# EAGLE design sfp-experimenter (EAGLE 7.7.0)
VERSION: v2
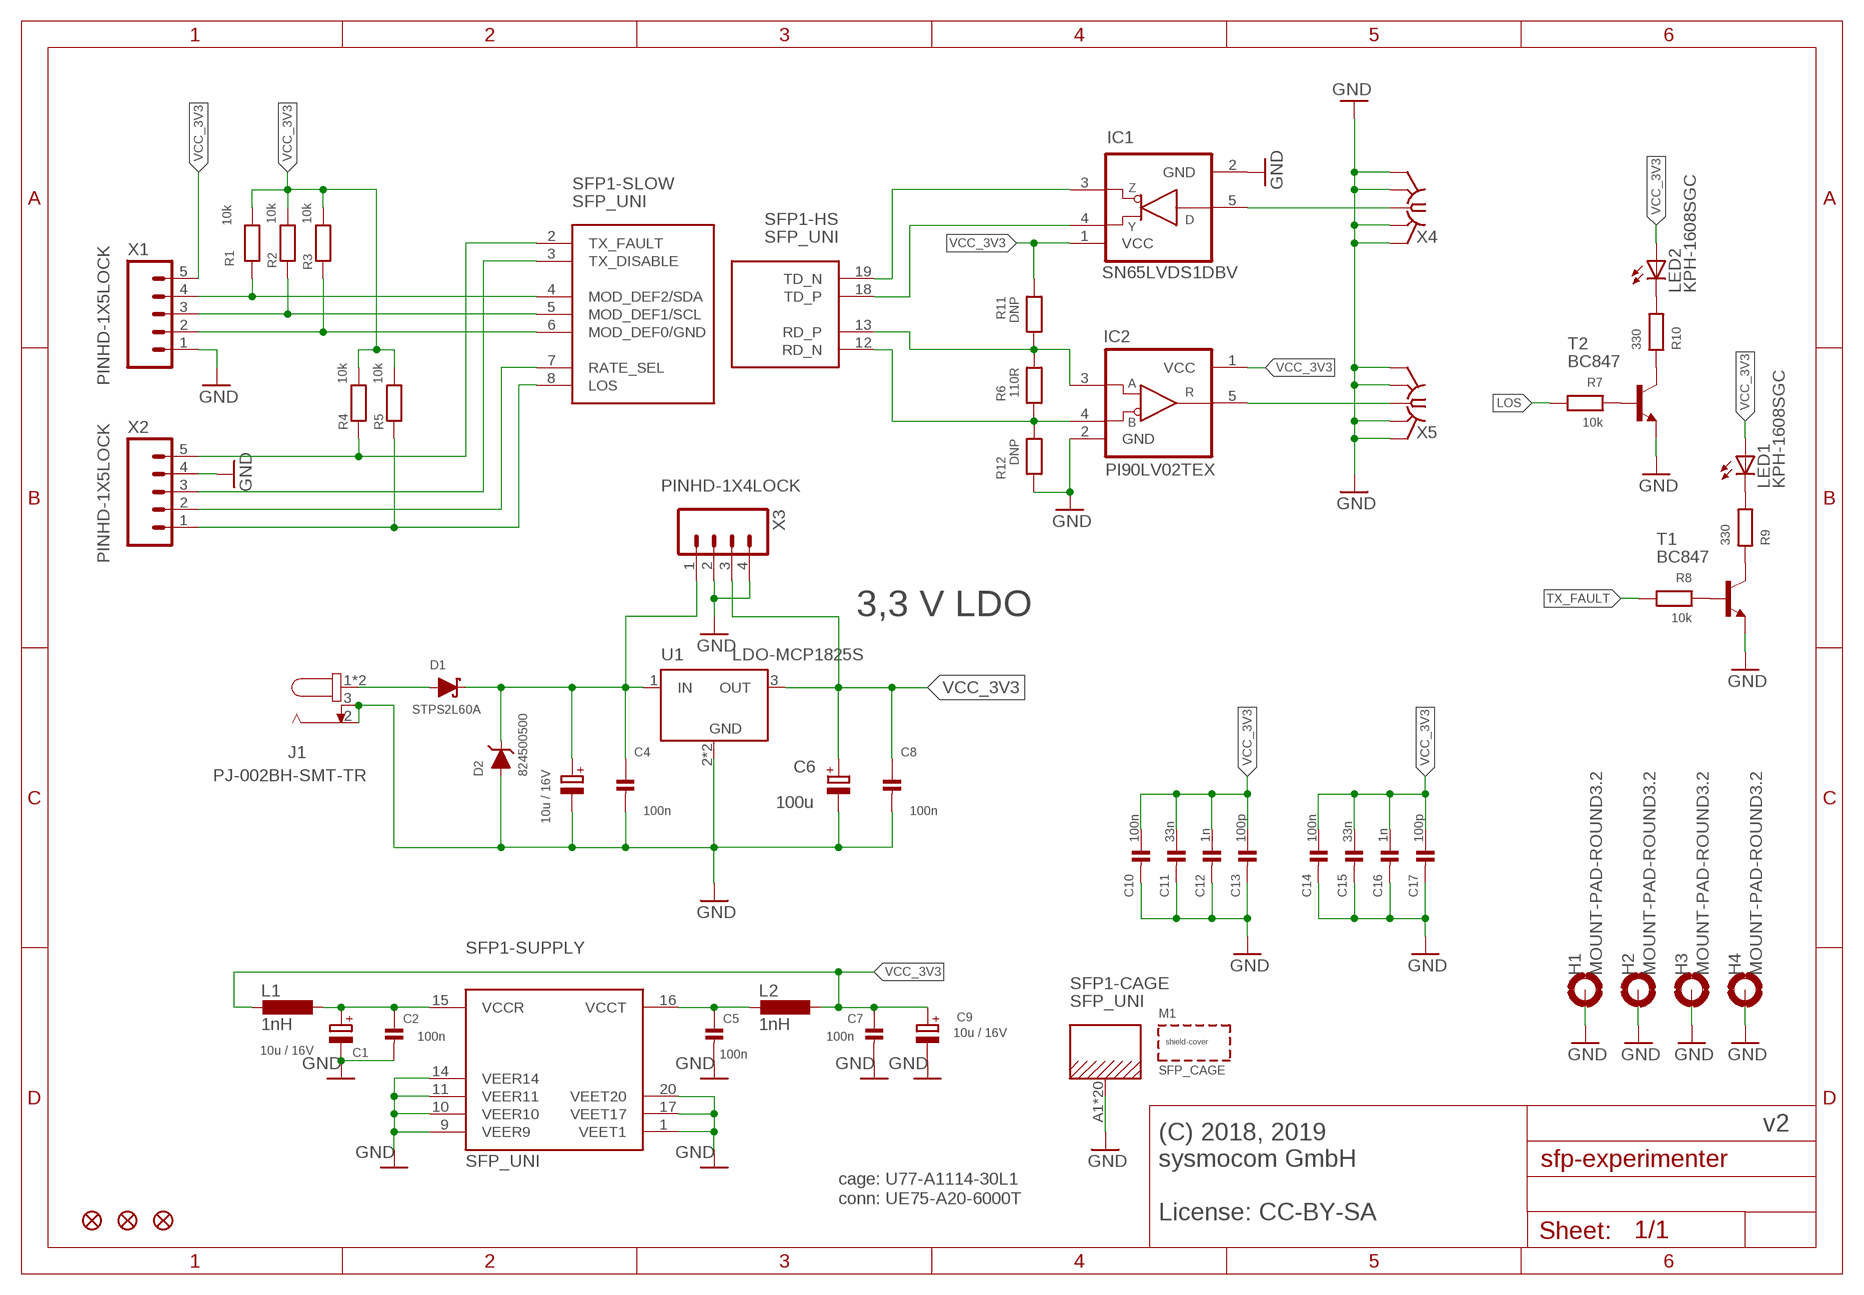
[diagram p0: schematic, sheet 1]
M1 (SHIELD-COVER): CLASS: MECHANICAL; DESCRIPTION: CONN SFP CAGE SLD R/A; LINK: https://www.digikey.de/product-detail/de/amphenol-icc-commercial-products/U77-A1114-30L1/U77-A1114-30L1-ND; MANUFACTURER: Amphenol ICC (Commercial Products); MANUFACTURERPARTNUMBER: U77-A1114-30L1; POPULATED: TRUE; ROHSCERTIFICATE: UNKNOWN ROHS CERTIFICATE; SCHEM_BOM_ITEM: TRUE; SOURCE: DIGIKEY; SOURCEPARTNUMBER: U77-A1114-30L1-ND

## Parts
C1  10u / 16V  CPOL-EU-1206  [CPOL1206]
C2  100n  CAP_CERAMIC_0603  [_0603]
C3  10u / 16V  CPOL-EU-1206  [CPOL1206]
C4  100n  CAP_CERAMIC_0603  [_0603]
C5  100n  CAP_CERAMIC_0603  [_0603]
C6  100u  CPOL-EUCT6032  [CT6032]
C7  100n  CAP_CERAMIC_0603  [_0603]
C8  100n  CAP_CERAMIC_0603  [_0603]
C9  10u / 16V  CPOL-EU-1206  [CPOL1206]
C10  100n  CAP_CERAMIC_0603  [_0603]
C11  33n  CAP_CERAMIC_0603  [_0603]
C12  1n  CAP_CERAMIC_0603  [_0603]
C13  100p  CAP_CERAMIC_0603  [_0603]
C14  100n  CAP_CERAMIC_0603  [_0603]
C15  33n  CAP_CERAMIC_0603  [_0603]
C16  1n  CAP_CERAMIC_0603  [_0603]
C17  100p  CAP_CERAMIC_0603  [_0603]
D1  STPS2L60A  DIODE-SCHOTTKY-SMA  [SMADIODE]
D2  824500500  DIODE-TVS-SMA  [SMADIODE]
FID1  FIDUCIAL1X2.5  [FIDUCIAL-1X2.5]
FID2  FIDUCIAL1X2.5  [FIDUCIAL-1X2.5]
FID3  FIDUCIAL1X2.5  [FIDUCIAL-1X2.5]
H1  MOUNT-PAD-ROUND3.2  [3,2-PAD]
H2  MOUNT-PAD-ROUND3.2  [3,2-PAD]
H3  MOUNT-PAD-ROUND3.2  [3,2-PAD]
H4  MOUNT-PAD-ROUND3.2  [3,2-PAD]
IC1  SN65LVDS1DBV  [SOT23-5]
IC2  PI90LV02TEX  SN65LVDT2DBV  [SOT23-5]
J1  PJ-002BH-SMT-TR  694108106102  [694108106102]
L1  1nH  L-EU_0603  [0603]
L2  1nH  L-EU_0603  [0603]
LED1  KPH-1608SGC  LEDCHIP-LED0603  [CHIP-LED0603]
LED2  KPH-1608SGC  LEDCHIP-LED0603  [CHIP-LED0603]
R1  10k  RESISTOR_0603  [_0603]
R2  10k  RESISTOR_0603  [_0603]
R3  10k  RESISTOR_0603  [_0603]
R4  10k  RESISTOR_0603  [_0603]
R5  10k  RESISTOR_0603  [_0603]
R6  110R  RESISTOR_0402  [_0402]
R7  10k  RESISTOR_0603  [_0603]
R8  10k  RESISTOR_0603  [_0603]
R9  330  RESISTOR_0603  [_0603]
R10  330  RESISTOR_0603  [_0603]
R11  DNP  RESISTOR_0603  [_0603]
R12  DNP  RESISTOR_0603  [_0603]
SFP1  SFP_UNI  [SFP_COMBINED]
T1  BC847  BC847C-NPN-SOT23-BEC  [SOT23-BEC]
T2  BC847  BC847C-NPN-SOT23-BEC  [SOT23-BEC]
U1  LDO-MCP1825S  [SOT223]
X1  PINHD-1X5LOCK  [1X05_LOCK]
X2  PINHD-1X5LOCK  [1X05_LOCK]
X3  PINHD-1X4LOCK  [1X04_LOCK]
X4  SMA-F-S-EDGE  [SMA-F-S-EDGE]
X5  SMA-F-S-EDGE  [SMA-F-S-EDGE]

## Nets
+VIN1 [supply]: C3.+ C4.1 D1.C D2.C U1.1(IN) X3.1
GND [GND-Polys]: C1.- C2.2 C3.- C4.2 C5.2 C6.- C7.2 C8.2 C9.- C10.2 C11.2 C12.2 C13.2 C14.2 C15.2 C16.2 C17.2 D2.A H1.B3,2(MOUNT) H2.B3,2(MOUNT) H3.B3,2(MOUNT) H4.B3,2(MOUNT) IC1.2(GND) IC2.2(GND) J1.2 J1.3 R12.2 SFP1.1(-SUPPLY:VEET1) SFP1.9(-SUPPLY:VEER9) SFP1.10(-SUPPLY:VEER10) SFP1.11(-SUPPLY:VEER11) SFP1.14(-SUPPLY:VEER14) SFP1.17(-SUPPLY:VEET17) SFP1.20(-SUPPLY:VEET20) SFP1.A1(-CAGE:CAGE) SFP1.A2(-CAGE:CAGE) SFP1.A3(-CAGE:CAGE) SFP1.A4(-CAGE:CAGE) SFP1.A5(-CAGE:CAGE) SFP1.A6(-CAGE:CAGE) SFP1.A7(-CAGE:CAGE) SFP1.A8(-CAGE:CAGE) SFP1.A10(-CAGE:CAGE) SFP1.A11(-CAGE:CAGE) SFP1.A12(-CAGE:CAGE) SFP1.B1(-CAGE:CAGE) SFP1.B2(-CAGE:CAGE) SFP1.B3(-CAGE:CAGE) SFP1.B4(-CAGE:CAGE) SFP1.B5(-CAGE:CAGE) SFP1.B6(-CAGE:CAGE) SFP1.B7(-CAGE:CAGE) SFP1.B8(-CAGE:CAGE) SFP1.B10(-CAGE:CAGE) T1.E T2.E U1.2(GND) U1.4(GND) X1.1 X2.4 X3.2 X3.4 X4.BG1(GND) X4.BG2(GND) X4.TG1(GND) X4.TG2(GND) X5.BG1(GND) X5.BG2(GND) X5.TG1(GND) X5.TG2(GND)
LOS: R5.1 R7.2 SFP1.8(-SLOW:LOS) X2.1
MOD_DEF0/GND: R3.1 SFP1.6(-SLOW:MOD_DEF0/GND) X1.2
MOD_DEF1/SCL: R2.1 SFP1.5(-SLOW:MOD_DEF1/SCL) X1.3
MOD_DEF2/SDA: R1.1 SFP1.4(-SLOW:MOD_DEF2/SDA) X1.4
N$1 [supply]: D1.A J1.1 J1.1-1
N$3: R7.1 T2.B
N$4: LED2.C R10.2
N$5 [supply]: C5.1 L2.2 SFP1.16(-SUPPLY:VCCT)
N$6 [supply]: C1.+ C2.1 L1.1 SFP1.15(-SUPPLY:VCCR)
N$7: R10.1 T2.C
N$138: R8.1 T1.B
N$139: LED1.C R9.2
N$141: R9.1 T1.C
RATE_SEL: SFP1.7(-SLOW:RATE_SEL) X2.2
RD [50ohm]: IC2.5(R) X5.C
RD_N [lvds]: IC2.4(B) R6.2 R12.1 SFP1.12(-HS:RD_N)
RD_P [lvds]: IC2.3(A) R6.1 R11.2 SFP1.13(-HS:RD_P)
TD [50ohm]: IC1.5(D) X4.C
TD_N [lvds]: IC1.3(Z) SFP1.19(-HS:TD_N)
TD_P [lvds]: IC1.4(Y) SFP1.18(-HS:TD_P)
TX_DISABLE: SFP1.3(-SLOW:TX_DISABLE) X2.3
TX_FAULT: R4.1 R8.2 SFP1.2(-SLOW:TX_FAULT) X2.5
VCC_3V3 [supply]: C6.+ C7.1 C8.1 C9.+ C10.1 C11.1 C12.1 C13.1 C14.1 C15.1 C16.1 C17.1 IC1.1(VCC) IC2.1(VCC) L1.2 L2.1 LED1.A LED2.A R1.2 R2.2 R3.2 R4.2 R5.2 R11.1 U1.3(OUT) X1.5 X3.3

## Notes on the sheet
- 3,3 V LDO
- cage: U77-A1114-30L1
- conn: UE75-A20-6000T
- (C) 2018, 2019 
  sysmocom GmbH
  
  License: CC-BY-SA

## Library data of the parts
C1 C3 C9 = sfp-experimenter:CPOL-EU; CLASS: CAPACITOR; DATASHEET: https://www.samsungsem.com/kr/support/product-search/mlcc/CL31A106KOHNNNE.jsp; DESCRIPTION: CAP CER 10UF 16V X5R 1206; LINK: https://www.digikey.com/en/products/detail/samsung-electro-mechanics/CL31A106KOHNNNE/3886795; MANUFACTURER: Samsung Electro-Mechanics; MANUFACTURERPARTNUMBER: CL31A106KOHNNNE; POPULATED: TRUE; ROHSCERTIFICATE: ROHS3 Compliant; SOURCE: DIGIKEY; SOURCEPARTNUMBER: 1276-1137-1-ND
C2 C4 C5 C7 C8 C10 C14 = sfp-experimenter:CAP_CERAMIC: Ceramic Capacitors 0402 - 0402 Surface Mount Capacitors 16pF 50V 5% [Digikey: 445-4899-2-ND] 18pF 50V 5% [Digikey: 490-1281-2-ND] 22pF 50V 5% [Digikey: 490-1283-2-ND] 68pF 50V 5% [Digikey: 490-1289-2-ND] 0.1uF 10V 10% [Digikey: 490-1318-2-ND] 1.0uF 6.3V 10% [Digikey: 490-1320-2-ND] 0603 - 0603 Surface Mount Capacitors 16 pF 50V 5% [Digikey: 445-5051-2-ND] 22 pF 50V [Digikey: PCC220ACVTR-ND] 33 pF 50V 5% [Digikey: 490-1415-1-ND] 56pF 50V 5% [Digikey: 490-1421-1-ND] 220pF 50V 5% [Digikey: 445-1285-1-ND] 680 pF 50V 2200 pF 50V 5% C0G [Digikey: 445-1297-1-ND] 5600 pF 100V 5% X7R [Digikey: 478-3711-1-ND] 0.1 µF 25V 10% [Digikey: PCC2277TR-ND] 0.22 µF 16V 10% X7R [Digikey: 445-1318-1-ND] 1.0 µF 25V 10% [Digikey: 445-5146-2-ND] 0603 - RF Specific 3pF 250V +/-0.1pF RF [Digikey: 712-1347-1-ND] 18 pF 250V 5% [Digikey: 478-3505-1-ND or 712-1322-1-ND] 56 pF 250V 5% C0G RF [Digikey: 490-4867-1-ND] 68 pF 250V RF [Digikey: 490-4868-1-ND] 0805 - 0805 Surface Mount Capacitors 220 pF 250V 2% RF Ceramic Capacitor [Digikey: 712-1398-1-ND] 1000 pF 50V 2% NP0 Ceramic Capacitor [Digikey: 478-3760-1-ND] 0.1 µF 25V 10% Ceramic Capacitor [Digikey: PCC1828TR-ND] 1.0 µF 16V 10% Ceramic Capacitor[Digikey: 490-1691-2-ND] 10.0 µF 10V 10% Ceramic Capacitor[Digikey: 709-1228-1-ND] 10.0 uF 16V 10% Ceramic Capacitor [Digikey: 478-5165-2-ND] 47 uF 6.3V 20% Ceramic Capacitor [Digikey: 587-1779-1-ND or 399-5506-1-ND] 1206 - 1206 Surface Mount Capacitors 47uF 10V 20% Ceramic Capacitor [Digikey: 490-5528-1-ND or 399-5508-1-ND or 445-6010-1-ND] 100uF 6.3V -20%, +80% Y5V Ceramic Capacitor (Digikey: 490-4512-1-ND, Mouser: 81-GRM31CF50J107ZE1L) 1810 - 1810 Surface Mount Capacitors High volt MLC; no solder stop between for higher isolation; CLASS: CAPACITOR; DATASHEET: http://www.samsungsem.com/kr/support/product-search/mlcc/CL10B104KO8NNNC.jsp; DESCRIPTION: CAP CER 0.1UF 16V X7R 0603; LINK: https://www.digikey.com/product-detail/en/samsung-electro-mechanics/CL10B104KO8NNNC/1276-1005-1-ND/3889091; MANUFACTURER: Samsung Electro-Mechanics; MANUFACTURERPARTNUMBER: CL10B104KO8NNNC; POPULATED: TRUE; ROHSCERTIFICATE: ROHS3 Compliant; SOURCE: DIGIKEY; SOURCEPARTNUMBER: 1276-1005-1-ND
C6 = rcl:CPOL-EU: POLARIZED CAPACITOR, European symbol; CLASS: CAPACITOR; DATASHEET: https://content.kemet.com/datasheets/KEM_T2076_T52X-530.pdf; DESCRIPTION: CAP TANT POLY 100UF 6.3V 2312; LINK: https://www.digikey.com/product-detail/en/kemet/T520C107M006ATE045/399-4658-1-ND/992091; MANUFACTURER: KEMET; MANUFACTURERPARTNUMBER: T520C107M006ATE045; POPULATED: TRUE; ROHSCERTIFICATE: ROHS3 Compliant; SOURCE: DIGIKEY; SOURCEPARTNUMBER: 399-4658-1-ND
C11 C15 = sfp-experimenter:CAP_CERAMIC: Ceramic Capacitors 0402 - 0402 Surface Mount Capacitors 16pF 50V 5% [Digikey: 445-4899-2-ND] 18pF 50V 5% [Digikey: 490-1281-2-ND] 22pF 50V 5% [Digikey: 490-1283-2-ND] 68pF 50V 5% [Digikey: 490-1289-2-ND] 0.1uF 10V 10% [Digikey: 490-1318-2-ND] 1.0uF 6.3V 10% [Digikey: 490-1320-2-ND] 0603 - 0603 Surface Mount Capacitors 16 pF 50V 5% [Digikey: 445-5051-2-ND] 22 pF 50V [Digikey: PCC220ACVTR-ND] 33 pF 50V 5% [Digikey: 490-1415-1-ND] 56pF 50V 5% [Digikey: 490-1421-1-ND] 220pF 50V 5% [Digikey: 445-1285-1-ND] 680 pF 50V 2200 pF 50V 5% C0G [Digikey: 445-1297-1-ND] 5600 pF 100V 5% X7R [Digikey: 478-3711-1-ND] 0.1 µF 25V 10% [Digikey: PCC2277TR-ND] 0.22 µF 16V 10% X7R [Digikey: 445-1318-1-ND] 1.0 µF 25V 10% [Digikey: 445-5146-2-ND] 0603 - RF Specific 3pF 250V +/-0.1pF RF [Digikey: 712-1347-1-ND] 18 pF 250V 5% [Digikey: 478-3505-1-ND or 712-1322-1-ND] 56 pF 250V 5% C0G RF [Digikey: 490-4867-1-ND] 68 pF 250V RF [Digikey: 490-4868-1-ND] 0805 - 0805 Surface Mount Capacitors 220 pF 250V 2% RF Ceramic Capacitor [Digikey: 712-1398-1-ND] 1000 pF 50V 2% NP0 Ceramic Capacitor [Digikey: 478-3760-1-ND] 0.1 µF 25V 10% Ceramic Capacitor [Digikey: PCC1828TR-ND] 1.0 µF 16V 10% Ceramic Capacitor[Digikey: 490-1691-2-ND] 10.0 µF 10V 10% Ceramic Capacitor[Digikey: 709-1228-1-ND] 10.0 uF 16V 10% Ceramic Capacitor [Digikey: 478-5165-2-ND] 47 uF 6.3V 20% Ceramic Capacitor [Digikey: 587-1779-1-ND or 399-5506-1-ND] 1206 - 1206 Surface Mount Capacitors 47uF 10V 20% Ceramic Capacitor [Digikey: 490-5528-1-ND or 399-5508-1-ND or 445-6010-1-ND] 100uF 6.3V -20%, +80% Y5V Ceramic Capacitor (Digikey: 490-4512-1-ND, Mouser: 81-GRM31CF50J107ZE1L) 1810 - 1810 Surface Mount Capacitors High volt MLC; no solder stop between for higher isolation; CLASS: CAPACITOR; DATASHEET: https://datasheets.avx.com/X7RDielectric.pdf; DESCRIPTION: CAP CER 0.033UF 50V X7R 0603; LINK: https://www.digikey.com/product-detail/en/avx-corporation/06035C333JAT2A/478-3723-1-ND/1116421; MANUFACTURER: AVX Corporation; MANUFACTURERPARTNUMBER: 06035C333JAT2A; POPULATED: TRUE; ROHSCERTIFICATE: ROHS3 Compliant; SOURCE: DIGIKEY; SOURCEPARTNUMBER: 478-3723-1-ND
C12 C16 = sfp-experimenter:CAP_CERAMIC: Ceramic Capacitors 0402 - 0402 Surface Mount Capacitors 16pF 50V 5% [Digikey: 445-4899-2-ND] 18pF 50V 5% [Digikey: 490-1281-2-ND] 22pF 50V 5% [Digikey: 490-1283-2-ND] 68pF 50V 5% [Digikey: 490-1289-2-ND] 0.1uF 10V 10% [Digikey: 490-1318-2-ND] 1.0uF 6.3V 10% [Digikey: 490-1320-2-ND] 0603 - 0603 Surface Mount Capacitors 16 pF 50V 5% [Digikey: 445-5051-2-ND] 22 pF 50V [Digikey: PCC220ACVTR-ND] 33 pF 50V 5% [Digikey: 490-1415-1-ND] 56pF 50V 5% [Digikey: 490-1421-1-ND] 220pF 50V 5% [Digikey: 445-1285-1-ND] 680 pF 50V 2200 pF 50V 5% C0G [Digikey: 445-1297-1-ND] 5600 pF 100V 5% X7R [Digikey: 478-3711-1-ND] 0.1 µF 25V 10% [Digikey: PCC2277TR-ND] 0.22 µF 16V 10% X7R [Digikey: 445-1318-1-ND] 1.0 µF 25V 10% [Digikey: 445-5146-2-ND] 0603 - RF Specific 3pF 250V +/-0.1pF RF [Digikey: 712-1347-1-ND] 18 pF 250V 5% [Digikey: 478-3505-1-ND or 712-1322-1-ND] 56 pF 250V 5% C0G RF [Digikey: 490-4867-1-ND] 68 pF 250V RF [Digikey: 490-4868-1-ND] 0805 - 0805 Surface Mount Capacitors 220 pF 250V 2% RF Ceramic Capacitor [Digikey: 712-1398-1-ND] 1000 pF 50V 2% NP0 Ceramic Capacitor [Digikey: 478-3760-1-ND] 0.1 µF 25V 10% Ceramic Capacitor [Digikey: PCC1828TR-ND] 1.0 µF 16V 10% Ceramic Capacitor[Digikey: 490-1691-2-ND] 10.0 µF 10V 10% Ceramic Capacitor[Digikey: 709-1228-1-ND] 10.0 uF 16V 10% Ceramic Capacitor [Digikey: 478-5165-2-ND] 47 uF 6.3V 20% Ceramic Capacitor [Digikey: 587-1779-1-ND or 399-5506-1-ND] 1206 - 1206 Surface Mount Capacitors 47uF 10V 20% Ceramic Capacitor [Digikey: 490-5528-1-ND or 399-5508-1-ND or 445-6010-1-ND] 100uF 6.3V -20%, +80% Y5V Ceramic Capacitor (Digikey: 490-4512-1-ND, Mouser: 81-GRM31CF50J107ZE1L) 1810 - 1810 Surface Mount Capacitors High volt MLC; no solder stop between for higher isolation; CLASS: CAPACITOR; DATASHEET: https://www.yageo.com/upload/media/product/productsearch/datasheet/mlcc/UPY-GPHC_X7R_6.3V-to-50V_18.pdf; DESCRIPTION: CAP CER 1000PF 50V X7R 0603; LINK: https://www.digikey.com/product-detail/en/yageo/CC0603KRX7R9BB102/311-1080-1-ND/302990; MANUFACTURER: Yageo; MANUFACTURERPARTNUMBER: CC0603KRX7R9BB102; POPULATED: TRUE; ROHSCERTIFICATE: ROHS3 Compliant; SOURCE: DIGIKEY; SOURCEPARTNUMBER: 311-1080-1-ND
C13 C17 = sfp-experimenter:CAP_CERAMIC: Ceramic Capacitors 0402 - 0402 Surface Mount Capacitors 16pF 50V 5% [Digikey: 445-4899-2-ND] 18pF 50V 5% [Digikey: 490-1281-2-ND] 22pF 50V 5% [Digikey: 490-1283-2-ND] 68pF 50V 5% [Digikey: 490-1289-2-ND] 0.1uF 10V 10% [Digikey: 490-1318-2-ND] 1.0uF 6.3V 10% [Digikey: 490-1320-2-ND] 0603 - 0603 Surface Mount Capacitors 16 pF 50V 5% [Digikey: 445-5051-2-ND] 22 pF 50V [Digikey: PCC220ACVTR-ND] 33 pF 50V 5% [Digikey: 490-1415-1-ND] 56pF 50V 5% [Digikey: 490-1421-1-ND] 220pF 50V 5% [Digikey: 445-1285-1-ND] 680 pF 50V 2200 pF 50V 5% C0G [Digikey: 445-1297-1-ND] 5600 pF 100V 5% X7R [Digikey: 478-3711-1-ND] 0.1 µF 25V 10% [Digikey: PCC2277TR-ND] 0.22 µF 16V 10% X7R [Digikey: 445-1318-1-ND] 1.0 µF 25V 10% [Digikey: 445-5146-2-ND] 0603 - RF Specific 3pF 250V +/-0.1pF RF [Digikey: 712-1347-1-ND] 18 pF 250V 5% [Digikey: 478-3505-1-ND or 712-1322-1-ND] 56 pF 250V 5% C0G RF [Digikey: 490-4867-1-ND] 68 pF 250V RF [Digikey: 490-4868-1-ND] 0805 - 0805 Surface Mount Capacitors 220 pF 250V 2% RF Ceramic Capacitor [Digikey: 712-1398-1-ND] 1000 pF 50V 2% NP0 Ceramic Capacitor [Digikey: 478-3760-1-ND] 0.1 µF 25V 10% Ceramic Capacitor [Digikey: PCC1828TR-ND] 1.0 µF 16V 10% Ceramic Capacitor[Digikey: 490-1691-2-ND] 10.0 µF 10V 10% Ceramic Capacitor[Digikey: 709-1228-1-ND] 10.0 uF 16V 10% Ceramic Capacitor [Digikey: 478-5165-2-ND] 47 uF 6.3V 20% Ceramic Capacitor [Digikey: 587-1779-1-ND or 399-5506-1-ND] 1206 - 1206 Surface Mount Capacitors 47uF 10V 20% Ceramic Capacitor [Digikey: 490-5528-1-ND or 399-5508-1-ND or 445-6010-1-ND] 100uF 6.3V -20%, +80% Y5V Ceramic Capacitor (Digikey: 490-4512-1-ND, Mouser: 81-GRM31CF50J107ZE1L) 1810 - 1810 Surface Mount Capacitors High volt MLC; no solder stop between for higher isolation; CLASS: CAPACITOR; DATASHEET: https://www.yageo.com/upload/media/product/productsearch/datasheet/mlcc/UPY-GP_NP0_16V-to-50V_18.pdf; DESCRIPTION: CAP CER 100PF 50V C0G/NPO 0603; LINK: https://www.digikey.com/product-detail/en/yageo/CC0603JRNPO9BN101/311-1069-1-ND/302979; MANUFACTURER: Yageo; MANUFACTURERPARTNUMBER: CC0603JRNPO9BN101; POPULATED: TRUE; ROHSCERTIFICATE: ROHS3 Compliant; SOURCE: DIGIKEY; SOURCEPARTNUMBER: 311-1069-1-ND
D1 = sfp-experimenter:DIODE-SCHOTTKY: Diode SMA Model Volts Amps Type Vf Vr Digikey # Notes SSA34-E3 40V 3A Schottky 480mV @ 3A 200uA @ 40V SSA34-E3/61TGITR-ND CDBA120-G 20V 1A Schottky 500mV @ 1A 500uA @ 20V 641-1014-6-ND REEL MBRA210 10V 2A Schottky 350mV @ 2A 700uA @ 10V MBRA210LT3 SOD-123 Model Volts Amps Type Vf Vr Order # Notes BAT54T1G 30V 200mA Schottky 800mV @ 200mA 2uA @ 25V BAT54T1GOSTR-ND B0530W 30V 500mA Schottky 430mV @ 500mA 130uA @ 30V B0530W-FDICT-ND REEL MBR120 1A 20V Schottky 340mV @ 1A MBR120VLSFT1GOSCT-ND SOD-323 Model Volts Amps Type Vf Vr Order # Notes PMEG2005EJ 20V 500mA Schottky 355mV @ 500mA 568-4110-1-ND ZLLS410 10V 570mA Schottky 380mV @ 570mA ZLLS410CT-ND 1N4148WS 75V 150mA Silicon/Simple 1V 1N4148WSFSCT-ND REEL SOD-523 Model Volts Amps Type Vf Vr Order # Notes BAT54XV2 30V 200mA Schottky 0.8V @ 100mA BAT54XV2CT-ND TB751S 30V 30mA Schottky RB751S-40TE61CT-ND SOT23-R/W (R = Solder Paste/Reflow Ovens, W = Hand-Soldering) Model Volts Amps Type Vf Vr Order # Notes BAT54FILM 40V 300mA Schottky 497-7162-1-ND; CLASS: DIODE; DATASHEET: https://www.st.com/content/ccc/resource/technical/document/datasheet/b7/ac/e1/7d/2a/e9/4b/e8/CD00003166.pdf/files/CD00003166.pdf/jcr:content/translations/en.CD00003166.pdf; DESCRIPTION: DIODE SCHOTTKY 60V 2A SMA; LINK: https://www.digikey.com/en/products/detail/stmicroelectronics/STPS2L60A/603486; MANUFACTURER: STMicroelectronics; MANUFACTURERPARTNUMBER: STPS2L60A; POPULATED: TRUE; ROHSCERTIFICATE: ROHS3 Compliant; SOURCE: DIGIKEY; SOURCEPARTNUMBER: 497-2461-1-ND
D2 = sfp-experimenter:DIODE-TVS; CLASS: DIODE; DATASHEET: https://www.bourns.com/docs/Product-Datasheets/SMAJ.pdf; DESCRIPTION: TVS DIODE 5VWM 9.2VC SMA; LINK: https://www.digikey.com/en/products/detail/bourns-inc/SMAJ5-0A/2254236; MANUFACTURER: Bourns Inc.; MANUFACTURERPARTNUMBER: SMAJ5.0A; POPULATED: TRUE; ROHSCERTIFICATE: ROHS3 Compliant; SOURCE: DIGIKEY; SOURCEPARTNUMBER: SMAJ5.0ABCT-ND
FID1-FID3 = microbuilder:FIDUCIAL: Fiducial Alignment Points Various fiducial points for machine vision alignment.; BOM: EXCLUDE
H1-H4 = sfp-experimenter:MOUNT-PAD-ROUND: MOUNTING PAD, round; CLASS: HOLE; DESCRIPTION: NO DESCRIPTION; LINK: UNKNOWN LINK; MANUFACTURER: UNKNOWN MANUFACTURER; MANUFACTURERPARTNUMBER: UNKNOWN MANUFACTURER PART NUMBER; POPULATED: FALSE; ROHSCERTIFICATE: UNKNOWN ROHS CERTIFICATE; SOURCE: UNKNOWN SOURCE; SOURCEPARTNUMBER: UNKNOWN SOURCE PART NUMBER
IC1 = sfp-experimenter:SN65LVDS1: Single LVDS Driver; CLASS: IC; DATASHEET: http://www.ti.com/general/docs/suppproductinfo.tsp?distId=10&gotoUrl=http%3A%2F%2Fwww.ti.com%2Flit%2Fgpn%2Fsn65lvds1; DESCRIPTION: IC DRIVER 1/0 SOT23-5; LINK: https://www.digikey.com/product-detail/en/texas-instruments/SN65LVDS1DBVR/296-6919-1-ND/371647; MANUFACTURER: Texas Instruments; MANUFACTURERPARTNUMBER: SN65LVDS1DBVR; POPULATED: TRUE; ROHSCERTIFICATE: ROHS3 Compliant; SOURCE: DIGIKEY; SOURCEPARTNUMBER: 296-6919-1-ND
IC2 = sfp-experimenter:SN65LVDT2: Single LVDS Receiver; CLASS: IC; DATASHEET: https://www.diodes.com/assets/Datasheets/PI90LV02.pdf; DESCRIPTION: IC RECEIVER 0/1 SOT23-5; LINK: https://www.digikey.com/en/products/detail/diodes-incorporated/PI90LV02TEX/1142813; MANUFACTURER: Diodes Incorporated; MANUFACTURERPARTNUMBER: PI90LV02TEX; POPULATED: TRUE; ROHSCERTIFICATE: ROHS3 Compliant; SOURCE: DIGIKEY; SOURCEPARTNUMBER: PI90LV02TEXCT-ND
J1 = sfp-experimenter:694108106102: WR-DC_DC Power Jack_Right Angled_SMT Center Pin Ø2.5_Plug ID Ø2.55_Plug OD Ø5.5_with 4 Soldering Pad & Peg ;=>Code : Con_WR-DC_SMT_694108106102_694108106102 <http://katalog.we-online.de/media/images/eican/Con_WR-DC_SMT_694108106102_pf2.jpg> Details see: http://katalog.we-online.de/em/datasheet/6941xx106102.pdf Created 2014-10-08, Karrer Zheng 2014 (C) Wurth Elektronik; CLASS: CONNECTOR\JUMPER; DATASHEET: https://www.cuidevices.com/product/resource/pj-002bh-smt-tr.pdf; DESCRIPTION: CONN PWR JACK 2.5X5.5MM SOLDER; LINK: https://www.digikey.com/product-detail/en/cui-devices/PJ-002BH-SMT-TR/CP-002BHPJCT-ND/669694; MANUFACTURER: CUI Devices; MANUFACTURERPARTNUMBER: PJ-002BH-SMT-TR; POPULATED: TRUE; ROHSCERTIFICATE: RoHS Compliant; SOURCE: DIGIKEY; SOURCEPARTNUMBER: CP-002BHPJCT-ND
L1 L2 = sfp-experimenter:L-EU: Inductor; CLASS: INDUCTOR; DATASHEET: https://abracon.com/Magnetics/new/AIMC-0603.pdf; DESCRIPTION: FIXED IND 1NH 500MA 50 MOHM SMD; LINK: https://www.digikey.com/product-detail/en/abracon-llc/AIMC-0603-1N0S-T/535-11529-1-ND/2782759; MANUFACTURER: Abracon LLC; MANUFACTURERPARTNUMBER: AIMC-0603-1N0S-T; POPULATED: TRUE; ROHSCERTIFICATE: RoHS Compliant; SOURCE: DIGIKEY; SOURCEPARTNUMBER: 535-11529-1-ND
LED1 LED2 = led:LED: LED OSRAM: - CHIPLED LG R971, LG N971, LY N971, LG Q971, LY Q971, LO R971, LY R971 LH N974, LH R974 LS Q976, LO Q976, LY Q976 LO Q996 - Hyper CHIPLED LW Q18S LB Q993, LB Q99A, LB R99A - SideLED LS A670, LO A670, LY A670, LG A670, LP A670 LB A673, LV A673, LT A673, LW A673 LH A674 LY A675 LS A676, LA A676, LO A676, LY A676, LW A676 LS A679, LY A679, LG A679 - Hyper Micro SIDELED® LS Y876, LA Y876, LO Y876, LY Y876 LT Y87S - SmartLED LW L88C, LW L88S LB L89C, LB L89S, LG L890 LS L89K, LO L89K, LY L89K LS L896, LA L896, LO L896, LY L896 - TOPLED LS T670, LO T670, LY T670, LG T670, LP T670 LSG T670, LSP T670, LSY T670, LOP T670, LYG T670 LG T671, LOG T671, LSG T671 LB T673, LV T673, LT T673, LW T673 LH T674 LS T676, LA T676, LO T676, LY T676, LB T676, LH T676, LSB T676, LW T676 LB T67C, LV T67C, LT T67C, LS T67K, LO T67K, LY T67K, LW E67C LS E67B, LA E67B, LO E67B, LY E67B, LB E67C, LV E67C, LT E67C LW T67C LS T679, LY T679, LG T679 LS T770, LO T770, LY T770, LG T770, LP T770 LB T773, LV T773, LT T773, LW T773 LH T774 LS E675, LA E675, LY E675, LS T675 LS T776, LA T776, LO T776, LY T776, LB T776 LHGB T686 LT T68C, LB T68C - Hyper Mini TOPLED® LB M676 - Mini TOPLED Santana® LG M470 LS M47K, LO M47K, LY M47K Source: http://www.osram.convergy.de LUXEON: - LUMILED® LXK2-PW12-R00, LXK2-PW12-S00, LXK2-PW14-U00, LXK2-PW14-V00 LXK2-PM12-R00, LXK2-PM12-S00, LXK2-PM14-U00 LXK2-PE12-Q00, LXK2-PE12-R00, LXK2-PE12-S00, LXK2-PE14-T00, LXK2-PE14-U00 LXK2-PB12-K00, LXK2-PB12-L00, LXK2-PB12-M00, LXK2-PB14-N00, LXK2-PB14-P00, LXK2-PB14-Q00 LXK2-PR12-L00, LXK2-PR12-M00, LXK2-PR14-Q00, LXK2-PR14-R00 LXK2-PD12-Q00, LXK2-PD12-R00, LXK2-PD12-S00 LXK2-PH12-R00, LXK2-PH12-S00 LXK2-PL12-P00, LXK2-PL12-Q00, LXK2-PL12-R00 Source: www.luxeon.com KINGBRIGHT: KA-3528ASYC Source: www.kingbright.com; CLASS: LED; DESCRIPTION: NO DESCRIPTION; LINK: UNKNOWN LINK; MANUFACTURER: UNKNOWN MANUFACTURER; MANUFACTURERPARTNUMBER: UNKNOWN MANUFACTURER PART NUMBER; POPULATED: TRUE; ROHSCERTIFICATE: UNKNOWN ROHS CERTIFICATE; SOURCE: UNKNOWN SOURCE; SOURCEPARTNUMBER: UNKNOWN SOURCE PART NUMBER
R1-R5 = sfp-experimenter:RESISTOR: Resistors 0402 - 0402 Surface Mount Package 22 Ohm 1% 1/16W [Digikey: 311-22.0LRTR-ND] 33 Ohm 5% 1/16W 1.0K 5% 1/16W 1.5K 5% 1/16W 2.0K 1% 1/16W 10.0K 1% 1/16W [Digikey: 311-10.0KLRTR-ND] 10.0K 5% 1/16W [Digikey: RMCF0402JT10K0TR-ND] 12.1K 1% 1/16W [Digikey: 311-22.0LRTR-ND] 100.0K 5% 1/16W 0603 - 0603 Surface Mount Package 1/10 Watt 0805 - 0805 Surface Mount Package 1/8 Watt 1206 - 1206 Surface Mount Package 2012 - 2010 Surface Mount Package 0.11 Ohm 1/2 Watt 1% Resistor - Digikey: RHM.11UCT-ND; CLASS: RESISTOR; DATASHEET: https://www.yageo.com/upload/media/product/productsearch/datasheet/rchip/PYu-RC_Group_51_RoHS_L_12.pdf; DESCRIPTION: RES 10K OHM 1% 1/10W 0603; LINK: https://www.digikey.com/en/products/detail/yageo/RC0603FR-0710KL/726880; MANUFACTURER: YAGEO; MANUFACTURERPARTNUMBER: RC0603FR-0710KL; POPULATED: TRUE; ROHSCERTIFICATE: ROHS3 Compliant; SOURCE: DIGIKEY; SOURCEPARTNUMBER: 311-10.0KHRCT-ND
R6 = sfp-experimenter:RESISTOR: Resistors 0402 - 0402 Surface Mount Package 22 Ohm 1% 1/16W [Digikey: 311-22.0LRTR-ND] 33 Ohm 5% 1/16W 1.0K 5% 1/16W 1.5K 5% 1/16W 2.0K 1% 1/16W 10.0K 1% 1/16W [Digikey: 311-10.0KLRTR-ND] 10.0K 5% 1/16W [Digikey: RMCF0402JT10K0TR-ND] 12.1K 1% 1/16W [Digikey: 311-22.0LRTR-ND] 100.0K 5% 1/16W 0603 - 0603 Surface Mount Package 1/10 Watt 0805 - 0805 Surface Mount Package 1/8 Watt 1206 - 1206 Surface Mount Package 2012 - 2010 Surface Mount Package 0.11 Ohm 1/2 Watt 1% Resistor - Digikey: RHM.11UCT-ND; CLASS: RESISTOR; DATASHEET: https://www.yageo.com/upload/media/product/productsearch/datasheet/rchip/PYu-RC_Group_51_RoHS_L_12.pdf; DESCRIPTION: RES 110 OHM 1% 1/10W 0603; LINK: https://www.digikey.com/en/products/detail/yageo/RC0603FR-13110RL/14286378; MANUFACTURER: YAGEO; MANUFACTURERPARTNUMBER: RC0603FR-13110RL; POPULATED: TRUE; ROHSCERTIFICATE: ROHS3 Compliant; SOURCE: DIGIKEY; SOURCEPARTNUMBER: 13-RC0603FR-13110RLCT-ND
R7 R8 = rc-sysmocom:RESISTOR: Resistors 0402 - 0402 Surface Mount Package 22 Ohm 1% 1/16W [Digikey: 311-22.0LRTR-ND] 33 Ohm 5% 1/16W 1.0K 5% 1/16W 1.5K 5% 1/16W 2.0K 1% 1/16W 10.0K 1% 1/16W [Digikey: 311-10.0KLRTR-ND] 10.0K 5% 1/16W [Digikey: RMCF0402JT10K0TR-ND] 12.1K 1% 1/16W [Digikey: 311-22.0LRTR-ND] 100.0K 5% 1/16W 0603 - 0603 Surface Mount Package 1/10 Watt 0805 - 0805 Surface Mount Package 1/8 Watt 1206 - 1206 Surface Mount Package 2012 - 2010 Surface Mount Package 0.11 Ohm 1/2 Watt 1% Resistor - Digikey: RHM.11UCT-ND; CLASS: RESISTOR; DATASHEET: https://www.yageo.com/upload/media/product/productsearch/datasheet/rchip/PYu-RC_Group_51_RoHS_L_12.pdf; DESCRIPTION: RES 10K OHM 1% 1/10W 0603; LINK: https://www.digikey.com/en/products/detail/yageo/RC0603FR-0710KL/726880; MANUFACTURER: YAGEO; MANUFACTURERPARTNUMBER: RC0603FR-0710KL; POPULATED: TRUE; ROHSCERTIFICATE: ROHS3 Compliant; SOURCE: DIGIKEY; SOURCEPARTNUMBER: 311-10.0KHRCT-ND
R9 R10 = rc-sysmocom:RESISTOR: Resistors 0402 - 0402 Surface Mount Package 22 Ohm 1% 1/16W [Digikey: 311-22.0LRTR-ND] 33 Ohm 5% 1/16W 1.0K 5% 1/16W 1.5K 5% 1/16W 2.0K 1% 1/16W 10.0K 1% 1/16W [Digikey: 311-10.0KLRTR-ND] 10.0K 5% 1/16W [Digikey: RMCF0402JT10K0TR-ND] 12.1K 1% 1/16W [Digikey: 311-22.0LRTR-ND] 100.0K 5% 1/16W 0603 - 0603 Surface Mount Package 1/10 Watt 0805 - 0805 Surface Mount Package 1/8 Watt 1206 - 1206 Surface Mount Package 2012 - 2010 Surface Mount Package 0.11 Ohm 1/2 Watt 1% Resistor - Digikey: RHM.11UCT-ND; CLASS: RESISTOR; DATASHEET: https://industrial.panasonic.com/ww/products/resistors/chip-resistors/general-purpose-chip-resistors/models/ERJ3GEYJ331V; DESCRIPTION: RES SMD 330 OHM 5% 1/10W 0603; LINK: https://www.digikey.com/product-detail/en/panasonic-electronic-components/ERJ-3GEYJ331V/P330GCT-ND/134778; MANUFACTURER: Panasonic Electronic Components; MANUFACTURERPARTNUMBER: ERJ-3GEYJ331V; POPULATED: TRUE; ROHSCERTIFICATE: ROHS3 Compliant; SOURCE: DIGIKEY; SOURCEPARTNUMBER: P330GCT-ND
R11 = sfp-experimenter:RESISTOR: Resistors 0402 - 0402 Surface Mount Package 22 Ohm 1% 1/16W [Digikey: 311-22.0LRTR-ND] 33 Ohm 5% 1/16W 1.0K 5% 1/16W 1.5K 5% 1/16W 2.0K 1% 1/16W 10.0K 1% 1/16W [Digikey: 311-10.0KLRTR-ND] 10.0K 5% 1/16W [Digikey: RMCF0402JT10K0TR-ND] 12.1K 1% 1/16W [Digikey: 311-22.0LRTR-ND] 100.0K 5% 1/16W 0603 - 0603 Surface Mount Package 1/10 Watt 0805 - 0805 Surface Mount Package 1/8 Watt 1206 - 1206 Surface Mount Package 2012 - 2010 Surface Mount Package 0.11 Ohm 1/2 Watt 1% Resistor - Digikey: RHM.11UCT-ND; CLASS: RESISTOR; DESCRIPTION: NO DESCRIPTION; LINK: UNKNOWN LINK; MANUFACTURER: UNKNOWN MANUFACTURER; MANUFACTURERPARTNUMBER: UNKNOWN MANUFACTURER PART NUMBER; POPULATED: FALSE; ROHSCERTIFICATE: UNKNOWN ROHS CERTIFICATE; SOURCE: UNKNOWN SOURCE; SOURCEPARTNUMBER: UNKNOWN SOURCE PART NUMBER
R12 = rc-sysmocom:RESISTOR: Resistors 0402 - 0402 Surface Mount Package 22 Ohm 1% 1/16W [Digikey: 311-22.0LRTR-ND] 33 Ohm 5% 1/16W 1.0K 5% 1/16W 1.5K 5% 1/16W 2.0K 1% 1/16W 10.0K 1% 1/16W [Digikey: 311-10.0KLRTR-ND] 10.0K 5% 1/16W [Digikey: RMCF0402JT10K0TR-ND] 12.1K 1% 1/16W [Digikey: 311-22.0LRTR-ND] 100.0K 5% 1/16W 0603 - 0603 Surface Mount Package 1/10 Watt 0805 - 0805 Surface Mount Package 1/8 Watt 1206 - 1206 Surface Mount Package 2012 - 2010 Surface Mount Package 0.11 Ohm 1/2 Watt 1% Resistor - Digikey: RHM.11UCT-ND; CLASS: RESISTOR; DATASHEET: https://www.koaspeer.com/pdfs/RK73H.pdf; DESCRIPTION: RES 100K OHM 1% 1/10W 0603; LINK: https://www.digikey.com/product-detail/en/koa-speer-electronics-inc/RK73H1JTTD1003F/2019-RK73H1JTTD1003FCT-ND/9846889; MANUFACTURER: KOA Speer Electronics, Inc.; MANUFACTURERPARTNUMBER: RK73H1JTTD1003F; POPULATED: FALSE; ROHSCERTIFICATE: ROHS3 Compliant; SOURCE: DIGIKEY; SOURCEPARTNUMBER: 2019-RK73H1JTTD1003FCT-ND
SFP1 = sfp-experimenter:SFP_UNI; CLASS: SFP; DATASHEET: https://media.digikey.com/pdf/Data%20Sheets/Amphenol%20PDFs/Ux75-A20-x00xx.pdf; DESCRIPTION: CONN SFP RCPT 20POS SLD R/A SMD; LINK: https://www.digikey.com/product-detail/en/amphenol-icc-commercial-products/UE75-A20-6000T/UE75-A20-6000TCT-ND/1242798; MANUFACTURER: Amphenol ICC (Commercial Products); MANUFACTURERPARTNUMBER: UE75-A20-6000T; POPULATED: TRUE; ROHSCERTIFICATE: RoHS Compliant; SOURCE: DIGIKEY; SOURCEPARTNUMBER: UE75-A20-6000TCT-ND
T1 T2 = transistor:*-NPN-: NPN Transistror BF959 corrected 2008.03.06; CLASS: TRANSISTOR; DESCRIPTION: TRANS NPN GP 100MA 45V SOT23; LINK: http://www.digikey.de/product-detail/de/foo/568-1636-1-ND; MANUFACTURER: NXP Semiconductors; MANUFACTURERPARTNUMBER: BC847C,215; POPULATED: TRUE; ROHSCERTIFICATE: Bleifrei / RoHS-konform; SOURCE: DIGIKEY; SOURCEPARTNUMBER: 568-1636-1-ND
U1 = sfp-experimenter:LDO; CLASS: IC; DATASHEET: https://ww1.microchip.com/downloads/en/DeviceDoc/22056b.pdf; DESCRIPTION: IC REG LIN 3.3V 500MA SOT223-3; LINK: https://www.digikey.com/en/products/detail/microchip-technology/MCP1825ST-3302E-DB/1635518; MANUFACTURER: Microchip Technology; MANUFACTURERPARTNUMBER: MCP1825ST-3302E/DB; POPULATED: TRUE; ROHSCERTIFICATE: ROHS3 Compliant; SOURCE: DIGIKEY; SOURCEPARTNUMBER: MCP1825ST-3302E/DBCT-ND
X1 X2 = sfp-experimenter:PINHD-1X5: Header 5 Standard 5-pin 0.1" header; CLASS: CONNECTOR; DESCRIPTION: NO DESCRIPTION; LINK: UNKNOWN LINK; MANUFACTURER: UNKNOWN MANUFACTURER; MANUFACTURERPARTNUMBER: UNKNOWN MANUFACTURER PART NUMBER; POPULATED: TRUE; ROHSCERTIFICATE: UNKNOWN ROHS CERTIFICATE; SOURCE: UNKNOWN SOURCE; SOURCEPARTNUMBER: UNKNOWN SOURCE PART NUMBER
X3 = sfp-experimenter:PINHD-1X4: Header 4 Standard 4-pin 0.1" header; CLASS: CONNECTOR; DESCRIPTION: NO DESCRIPTION; LINK: UNKNOWN LINK; MANUFACTURER: UNKNOWN MANUFACTURER; MANUFACTURERPARTNUMBER: UNKNOWN MANUFACTURER PART NUMBER; POPULATED: TRUE; ROHSCERTIFICATE: UNKNOWN ROHS CERTIFICATE; SOURCE: UNKNOWN SOURCE; SOURCEPARTNUMBER: UNKNOWN SOURCE PART NUMBER
X4 X5 = sfp-experimenter:SMA-F; CLASS: CONNECTOR; DESCRIPTION: NO DESCRIPTION; LINK: UNKNOWN LINK; MANUFACTURER: UNKNOWN MANUFACTURER; MANUFACTURERPARTNUMBER: UNKNOWN MANUFACTURER PART NUMBER; POPULATED: TRUE; ROHSCERTIFICATE: UNKNOWN ROHS CERTIFICATE; SOURCE: UNKNOWN SOURCE; SOURCEPARTNUMBER: UNKNOWN SOURCE PART NUMBER

## Net classes
1 lvds: width 0.33 mm, clearance 0.25 mm
2 GND-Polys: width 1 mm, clearance 0.3 mm to class 0, clearance 0.6 mm to class 1, clearance 0.6 mm
3 supply: width 0.6 mm, clearance 0.038 mm to class 1
4 50ohm: width 0.65 mm, clearance 0.6 mm to class 1

## Board
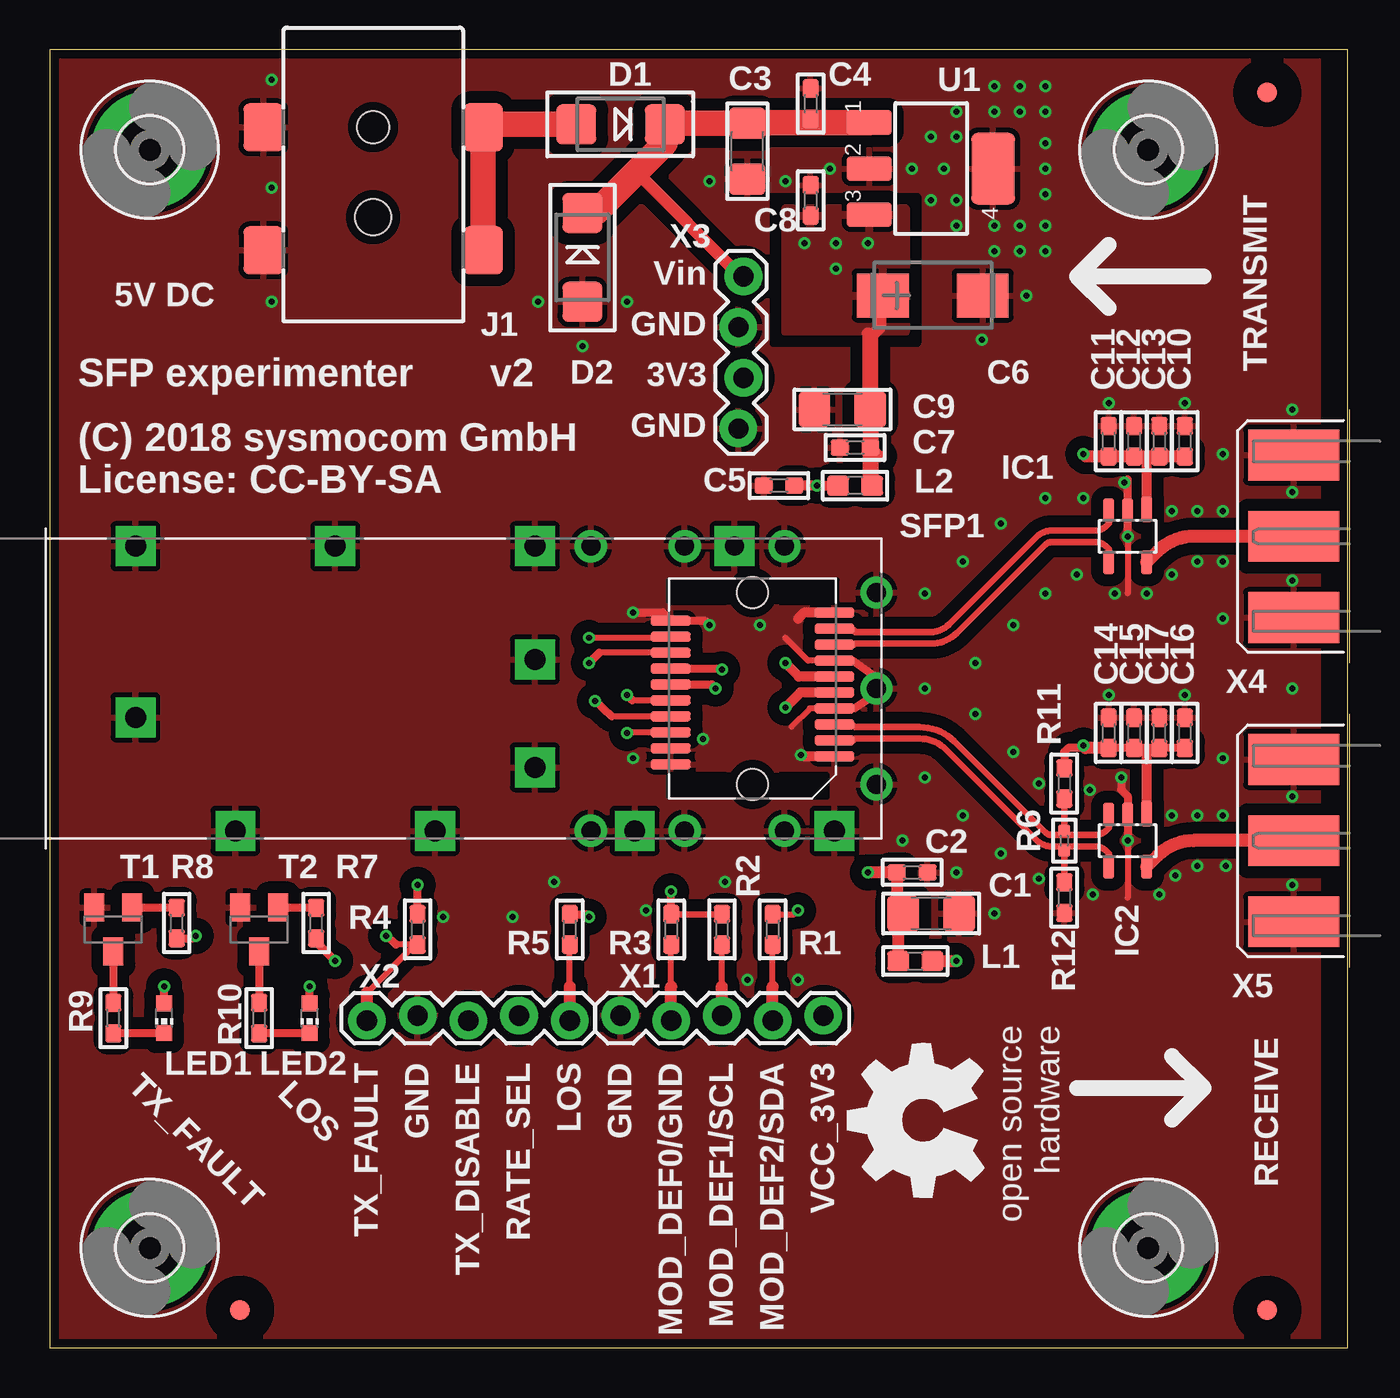
[diagram p1: board, top side]
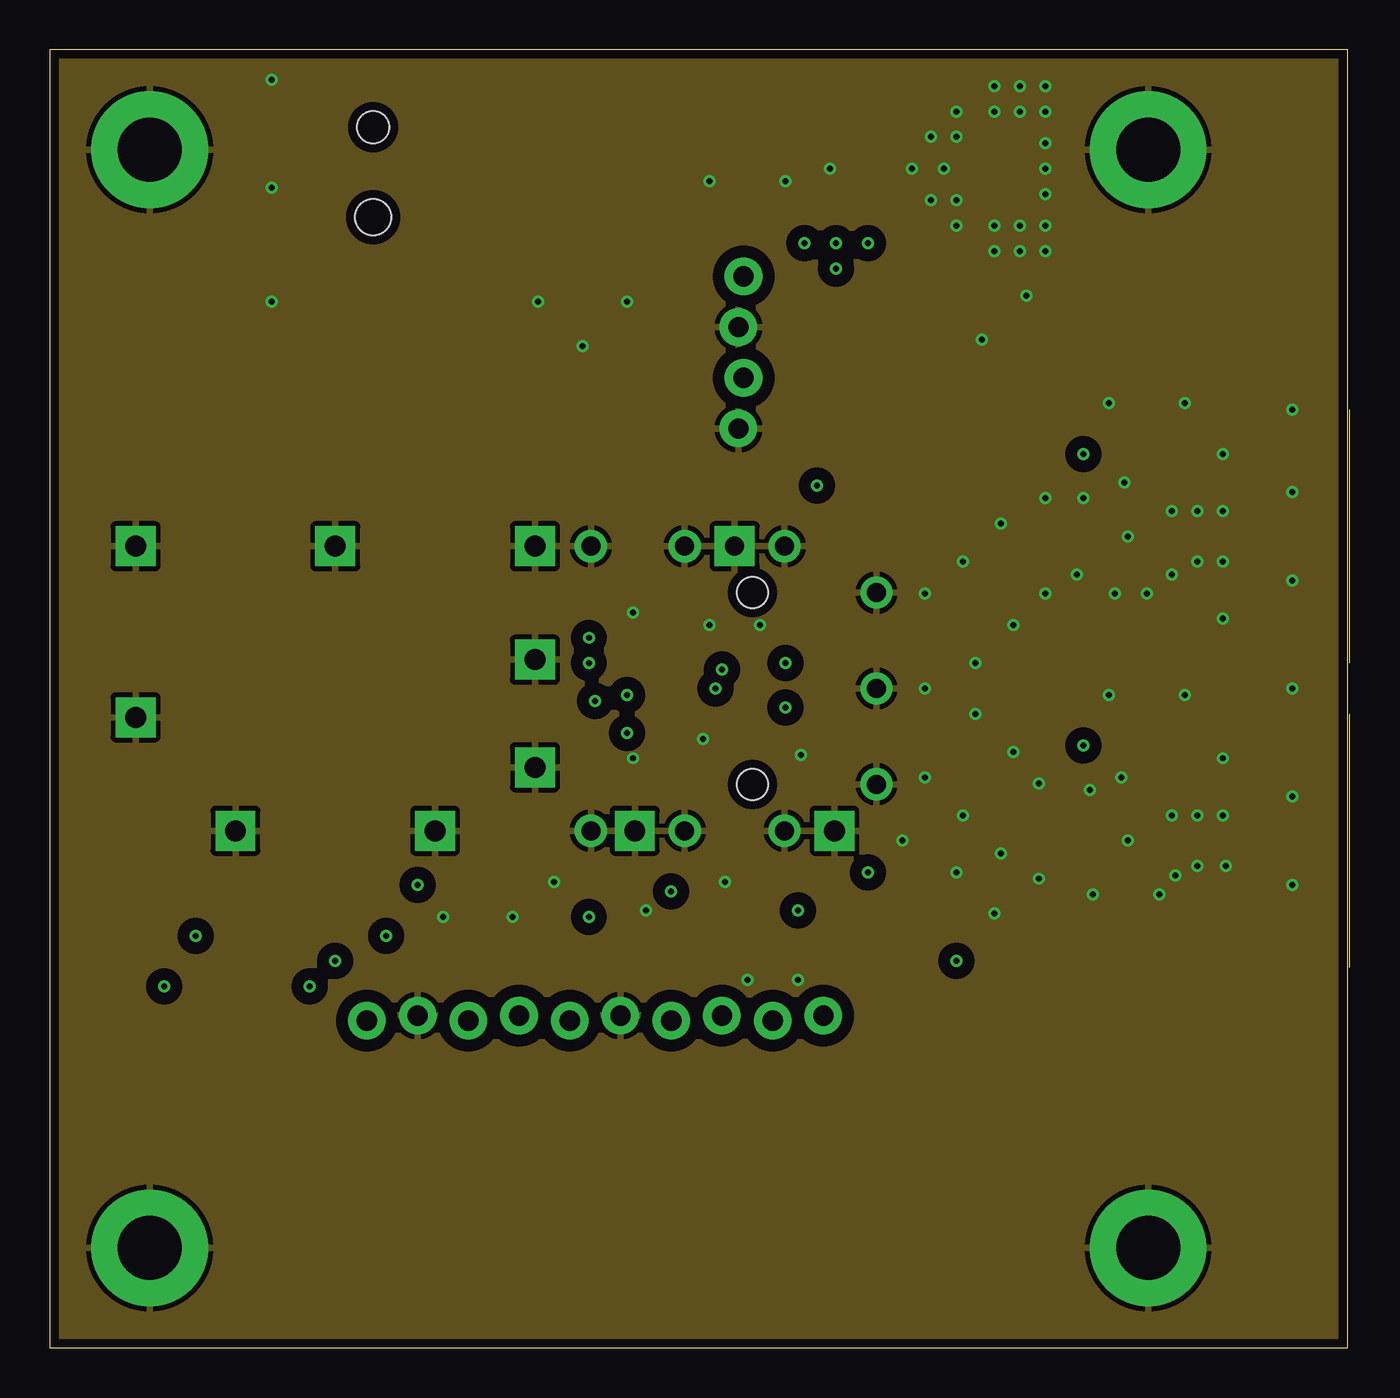
[diagram p2: board, inner layer layer2]
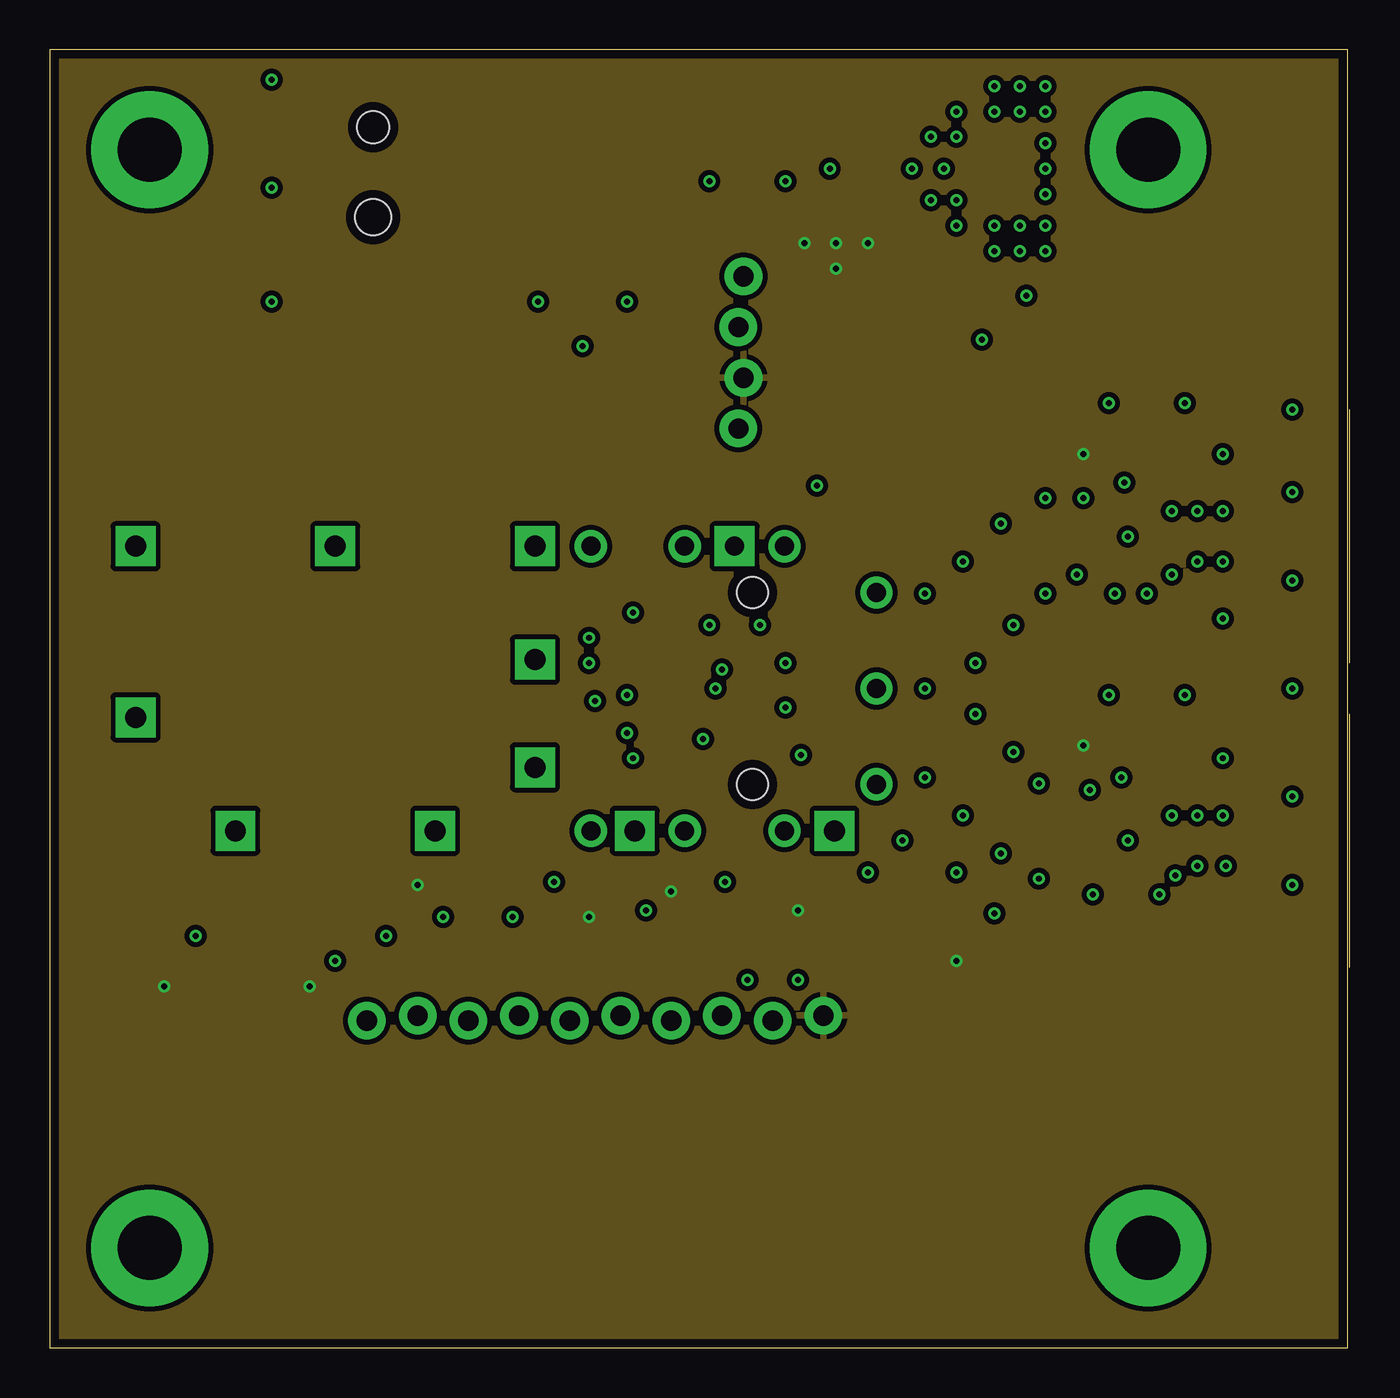
[diagram p3: board, inner layer layer3]
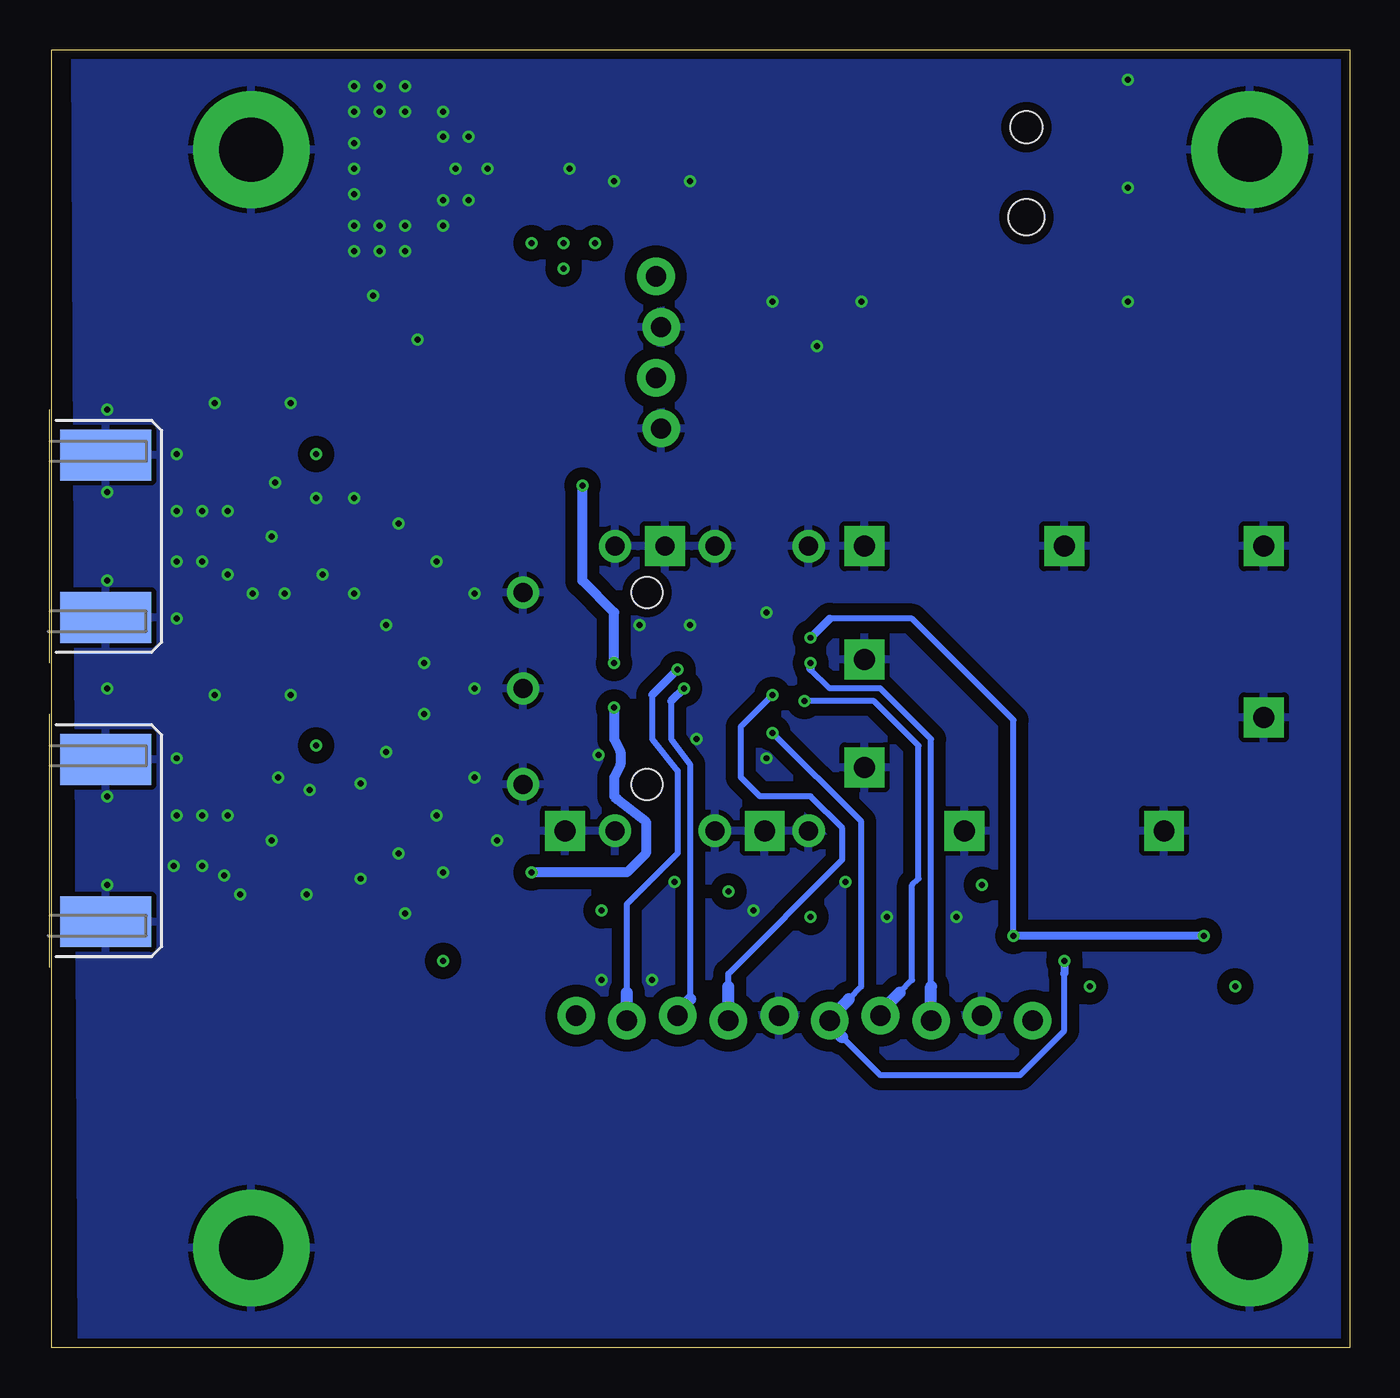
[diagram p4: board, bottom side, seen from below]

Size 65 x 65 mm. Coordinates in mm from the lower left corner, seen from the top.
Outline: 0,0 65,0 65,65 0,65 0,0
Copper layers (1+2*15+16): Top 0.035mm / dielectric 0.36mm / layer2 0.035mm / dielectric 0.71mm / layer3 0.035mm / dielectric 0.36mm / Bottom 0.035mm
Design rules "sysmocom-basista-4layer-prototype *": minimum track width 0.15mm, minimum drill 0.3mm, track to track 0.25mm, track to pad 0.25mm, pad to pad 0.25mm, via to via 0.25mm, smd to smd 0mil, copper to edge 0.45mm, drill to drill 0.25mm, minimum pad ring 0.15mm, minimum via ring 0.15mm, stop-mask expansion 0mil, vias tented up to drill 0mil, thermal gap 10mil

### Footprints (pad centres in the part's own frame; a part is rotated, then mirrored left to right if it is on the bottom)
CPOL1206 = smd 1.6 x 1.8: + 1.4,0; - -1.4,0
_0603 = smd 0.9 x 0.8: 1 -0.762,0; 2 0.762,0
CT6032 = smd 2.6 x 2.2: + -2.5,0; - 2.5,0
SMADIODE = smd 2 x 2: A 2.223,0; C -2.223,0
FIDUCIAL-1X2.5 = smd 1 x 1: 1 0,0
3,2-PAD = drill 3.2 pad 5.842: B3,2 0,0
SOT23-5 = smd 0.55 x 1.3: 1 -0.95,-1.35 | smd 0.55 x 1.2: 2 0,-1.3; 3 0.95,-1.3; 4 0.95,1.3; 5 -0.95,1.3
694108106102 = smd 2.4 x 2: 1 11.15,5.5; 1-1 5,5.5; 2 5,-5.5; 3 11.15,-5.5 | hole 1.6: 5,0 | hole 1.8: 9.5,0
0603 = smd 1.1 x 1: 1 -0.85,0; 2 0.85,0
CHIP-LED0603 = smd 0.8 x 0.8: A 0,-0.75; C 0,0.75
_0402 = smd 0.6 x 0.6: 1 -0.508,0; 2 0.508,0
SFP_COMBINED = smd 2 x 0.5: 1 -3.2,3.4; 2 -3.2,2.6; 3 -3.2,1.8; 4 -3.2,1; 5 -3.2,0.2; 6 -3.2,-0.6; 7 -3.2,-1.4; 8 -3.2,-2.2; 9 -3.2,-3; 10 -3.2,-3.8; 11 5,-3.4; 12 5,-2.6; 13 5,-1.8; 14 5,-1; 15 5,-0.2; 16 5,0.6; 17 5,1.4; 18 5,2.2; 19 5,3; 20 5,3.8 | drill 1.05 pad 2 square: A1 -30,7.125; A2 -20,7.125; A3 -10,7.125; A5 -25,-7.125; A6 -15,-7.125; A7 -5,-7.125; A8 5,-7.125; A10 -30,-1.45; A11 -10,1.45; A12 -10,-3.95 | drill 0.95 pad 2 square: A4 0,7.125 | drill 0.95: B1 -7.2,7.125; B2 -2.5,7.125; B3 2.5,7.125; B7 2.5,-7.125; B8 -2.5,-7.125; B10 -7.2,-7.125 | drill 0.95 pad 1.27: B4 7.1,4.8; B5 7.1,0; B6 7.1,-4.8 | hole 1.55: 0.9,4.8; 0.9,-4.8
SOT23-BEC = smd 1 x 1.4: B -0.95,-1.1; C 0,1.1; E 0.95,-1.1
SOT223 = smd 1.219 x 2.235: 1 -2.311,-3.099; 2 0,-3.099; 3 2.311,-3.099 | smd 3.6 x 2.2: 4 0,3.099
1X05_LOCK = drill 1.016 pad 1.88: 1 0,0.127; 2 2.54,-0.127; 3 5.08,0.127; 4 7.62,-0.127; 5 10.16,0.127
1X04_LOCK = drill 1.016 pad 1.88: 1 0,0.127; 2 2.54,-0.127; 3 5.08,0.127; 4 7.62,-0.127
SMA-F-S-EDGE = smd 4.572 x 2.54 bottom: BG1 2.794,-4.064; BG2 2.794,4.064 | smd 4.572 x 2.54: C 2.794,0; TG1 2.794,-4.064; TG2 2.794,4.064

### Placement (x,y rotation side)
C1  44.13,21.75 180 top
C2  43.18,23.81 0 top
C3  34.92,59.93 90 top
C4  38.1,62.31 90 top
C5  36.51,43.18 180 top
C6  44.21,52.7 0 top
C7  40.32,45.09 180 top
C8  38.1,57.47 90 top
C9  39.69,46.99 0 top
C10  56.83,45.4 90 top
C11  53.02,45.4 90 top
C12  54.29,45.4 90 top
C13  55.56,45.4 90 top
C14  53.02,30.8 90 top
C15  54.29,30.8 90 top
C16  56.83,30.8 90 top
C17  55.56,30.8 90 top
D1  28.57,61.28 180 top
D2  26.67,54.61 270 top
FID1  9.53,1.91 0 top
FID2  60.96,62.87 0 top
FID3  60.96,1.91 0 top
H1  5,5 0 top
H2  55,60 0 top
H3  55,5 0 top
H4  5,60 0 top
IC1  53.98,40.64 180 top
IC2  53.98,25.4 180 top
J1  16.19,66.12 270 top
L1  43.34,19.37 0 top
L2  40.32,43.18 180 top
LED1  5.71,16.51 180 top
LED2  13.02,16.51 180 top
R1  36.2,20.95 90 top
R2  33.66,20.95 90 top
R3  31.11,20.95 90 top
R4  18.41,20.95 90 top
R5  26.04,20.95 90 top
R6  50.8,25.4 270 top
R7  13.34,21.27 270 top
R8  6.35,21.27 270 top
R9  3.17,16.51 270 top
R10  10.48,16.51 270 top
R11  50.8,28.26 270 top
R12  50.8,22.54 270 top
SFP1  34.29,33.02 0 top
T1  3.17,20.95 180 top
T2  10.48,20.95 180 top
U1  44.13,59.05 270 top
U$1  [OSHW_8MM]  43.74,11.37 90 top
X1  28.57,16.51 0 top
X2  26.04,16.51 180 top
X3  34.61,53.66 270 top
X4  65.09,40.64 180 top
X5  65.09,25.4 180 top

### Tracks (layer width: path | path; a pad name or v marks a point on that pad's centre or on a via)
+VIN1
  Top 0.305: C4.1 37.96,61.55 38.1,61.37
  Top 0.6: X3.1 34.61,53.66 29.37,58.9
  Top 1.27: D2.C 27.3,56.83 29.37,58.9 30.8,60.33 D1.C 30.85,61.33 C3.+ 34.96,61.37 38.1,61.37 U1.1
GND  (via drill 0.3)
  Top 0.305: 40.27,32.02 SFP1.14 38.05,32.02 37.15,31.11 | SFP1.17 37.97,34.42 36.83,35.56 | IC1.2 53.98,41.91 | v53.98,40.64 53.98,37.78 | v53.98,25.4 53.98,22.54
  Top 0.406: SFP1.B5 41.39,32.5 | SFP1.17 40.19,34.42 41.27,33.66 41.27,33.13 SFP1.B5 | 40.27,32.02 41.27,32.7 41.27,32.91 SFP1.B5 | v53.66,28.57 53.66,27.94 53.98,27.62 IC2.2 v53.98,25.4 | IC1.2 53.98,43.5 | v53.98,40.64 53.98,41.91 | v29.21,36.83 30.68,36.83 SFP1.1 32.8,36.42 v33.02,36.2
  Top 0.5: SFP1.20 37.77,36.82 37.47,36.51 | SFP1.11 37.69,29.62 v37.62,29.69
  other vias: 58.74,26.67 58.9,24.13 57.47,26.67 57.47,24.13 56.36,23.65 56.2,26.67 55.56,22.7 58.74,39.37 58.74,41.91 57.47,41.91 57.47,39.37 56.2,38.73 56.2,41.91 54.93,37.78 53.34,37.78 52.23,22.7 53.02,47.31 56.83,47.31 53.02,32.7 56.83,32.7 29.21,29.53 35.56,36.2 32.7,30.48 47.31,21.75 42.7,25.4 45.4,23.81 19.68,21.59 23.18,21.59 29.84,21.91 37.47,18.41 34.92,18.41 33.81,23.34 43.81,33.02 46.35,34.29 48.26,36.2 49.85,37.78 51.44,38.73 52.07,27.94 49.53,28.26 48.26,29.84 46.35,31.75 58.74,36.51 58.74,29.53 62.23,33.02 62.23,38.42 62.23,27.62 62.23,23.18 62.23,42.86 58.74,44.77 62.23,46.99 43.81,37.78 43.81,28.57 45.72,26.67 47.62,24.77 49.53,23.5 49.85,42.55 51.75,42.55 47.62,41.27 45.72,39.37 11.11,63.5 11.11,52.39 11.11,58.1 25.24,23.34 24.45,52.39 28.89,52.39 26.67,50.16 47.31,54.93 48.9,52.7 46.67,50.48 47.31,61.91 47.31,56.2 49.85,60.33 49.85,59.05 49.85,57.78 49.85,56.2 49.85,61.91 33.02,58.42 36.83,58.42 39.05,59.05 45.4,61.91 45.4,56.2 45.4,57.47 45.4,60.64 44.13,60.64 44.13,57.47 44.77,59.05 43.18,59.05 47.31,63.18 49.85,63.18 49.85,54.93 48.58,63.18 48.58,61.91 48.58,56.2 48.58,54.93 53.82,43.34
  pour Top (rank 2): 0.32,64.84 63.5,64.84 63.5,0.32 0.32,0.32
  pour Bottom (rank 2): 0,0 63.5,0 63.82,64.85 0.32,64.85
  pour layer2: 0.32,65.09 64.77,65.09 64.77,0.32 0.32,0.32
LOS  (via drill 0.3)
  Top 0.305: 26.04,18.1 R5.1 | SFP1.8 28.91,30.82
  Top 0.406: 28.91,30.82 v28.89,30.8 | R7.2 13.34,20.32 v14.29,19.37
  Top 0.61: 26.04,18.1 X2.1
  Bottom 0.305: v28.89,30.8 24.45,26.35 24.45,18.1 25.08,17.46 | 25.4,15.56 23.5,13.65 16.51,13.65 14.29,15.88 14.29,18.73
  Bottom 0.406: v14.29,19.37 14.29,18.73
  Bottom 0.61: 25.08,17.46 26.04,16.51 X2.1 26.04,16.19 25.4,15.56
MOD_DEF0/GND  (via drill 0.3)
  Top 0.305: 31.11,18.1 R3.1 | SFP1.6 29.18,32.42
  Top 0.406: 29.18,32.42 v28.89,32.7
  Top 0.61: X1.2 31.11,18.1
  Bottom 0.305: 31.11,18.1 31.11,18.73 25.4,24.45 25.4,26.04 26.99,27.62 29.53,27.62 30.48,28.57 30.48,31.11 v28.89,32.7
  Bottom 0.61: X1.2 31.11,18.1
MOD_DEF1/SCL  (via drill 0.3)
  Top 0.305: 33.66,18.1 R2.1
  Top 0.406: SFP1.5 33.14,33.22 v33.34,33.02
  Top 0.61: X1.3 33.66,18.1
  Bottom 0.305: 33.97,32.38 33.97,30.48 33.02,29.21 33.02,17.46
  Bottom 0.406: v33.34,33.02 33.97,32.38 | 33.66,16.83 X1.3
  Bottom 0.61: 33.02,17.46 33.66,16.83
MOD_DEF2/SDA  (via drill 0.3)
  Top 0.305: 36.2,18.1 R1.1
  Top 0.406: SFP1.4 33.61,34.02 v33.66,33.97
  Top 0.61: X1.4 36.2,18.1
  Bottom 0.305: 36.2,17.78 36.2,22.23 33.66,24.77 33.66,28.89 34.92,30.48 34.92,32.7
  Bottom 0.406: v33.66,33.97 34.92,32.7
  Bottom 0.61: X1.4 36.2,17.78
N$1
  Top 1.27: J1.1 J1.1-1 21.85,61.28 D1.A
N$3
  Top 0.406: T2.B 13.31,22.05 R7.1
N$4
  Top 0.406: LED2.C R10.2
N$5  (via drill 0.3)
  Top 0.5: SFP1.16 37.5,33.62 v36.83,34.29 | L2.2 v38.42,43.18 C5.1
  Bottom 0.5: v36.83,34.29 36.83,36.83 38.42,38.42 v38.42,43.18
N$6  (via drill 0.3)
  Top 0.5: SFP1.15 37.58,32.82 v36.83,32.07
  Top 0.61: v40.96,23.81 C2.1 42.42,22.06 C1.+ 42.49,21.5 L1.1
  Bottom 0.5: v36.83,32.07 36.83,30.48 36.51,29.84 36.51,29.21 36.83,28.57 36.83,27.62 36.67,27.46 35.24,26.35 35.24,24.77 36.2,23.81 v40.96,23.81
N$7
  Top 0.406: T2.C R10.1
N$138
  Top 0.406: T1.B 6.33,22.05 R8.1
N$139
  Top 0.406: LED1.C 3.19,15.76 R9.2
N$141
  Top 0.406: T1.C R9.1
RATE_SEL  (via drill 0.3)
  Top 0.305: SFP1.7 28.13,31.62
  Top 0.406: 28.13,31.62 v27.3,32.38
  Bottom 0.305: v27.3,32.38 23.81,32.38 21.59,30.16 21.59,23.5 21.91,23.18 21.91,18.41 22.54,17.78
  Bottom 0.61: 22.54,17.78 23.5,16.83 X2.2
RD
  Top 0.65: X5.C 57.28,25.4 arc45 55.48,24.66 IC2.5
RD_N
  Top 0.26: IC2.4 arc45 IC2.4
  Top 0.33: 50.8,25.11 50.16,25.11 arc-45 49.42,25.42 44.88,29.96 arc45 43.55,30.51 40.32,30.51 arc-45 40.11,30.42 SFP1.12 | 50.8,25.11 52.39,25.11 arc-45 52.88,24.91 53.02,24.77 IC2.4 arc45 IC2.4 | 50.8,25.11 R6.2 R12.1
RD_P
  Top 0.26: SFP1.13 39.81,31.22 | IC2.3 arc-45 IC2.3
  Top 0.305: R6.1 50.8,25.69
  Top 0.33: 39.81,31.22 40,31.22 arc-45 40.32,31.09 43.55,31.09 arc-45 45.29,30.37 49.83,25.83 arc45 50.16,25.69 50.8,25.69 52.39,25.69 arc45 52.88,25.89 53.02,26.04 IC2.3 arc-45 IC2.3 | R6.1 R11.2
TD
  Top 0.65: X4.C 57.28,40.64 arc45 55.48,39.9 IC1.5
TD_N
  Top 0.26: SFP1.19 40.07,36.02 | IC1.3 arc-45 IC1.3
  Top 0.33: 40.07,36.02 arc-45 40.21,35.96 40.32,35.85 44.13,35.85 arc45 45.01,36.21 49.42,40.62 arc-45 50.16,40.93 52.39,40.93 arc45 52.88,41.13 53.02,41.27 IC1.3 arc-45 IC1.3
TD_P
  Top 0.26: IC1.4 arc45 IC1.4
  Top 0.33: SFP1.18 40.2,35.22 arc45 40.32,35.27 44.13,35.27 arc45 45.42,35.8 49.83,40.21 arc-45 50.16,40.35 52.39,40.35 arc-45 52.88,40.15 53.02,40.01 IC1.4 arc45 IC1.4
TX_DISABLE  (via drill 0.3)
  Top 0.305: SFP1.3 27.52,34.82
  Top 0.406: 27.52,34.82 v26.99,34.29
  Bottom 0.305: 26.99,33.97 26.04,33.02 23.5,33.02 20.95,30.48 20.95,18.1
  Bottom 0.406: 26.99,33.97 v26.99,34.29
  Bottom 0.61: X2.3 20.95,18.1
TX_FAULT  (via drill 0.3)
  Top 0.305: 18.41,20 R4.1 | R4.1 17.34,20.19 | 31.03,35.56 v26.99,35.56 | 15.88,17.78 18.29,20.19 R4.1
  Top 0.406: 17.34,20.19 v16.83,20.64 | SFP1.2 31.03,35.56 | R8.2 7.18,20.51 v7.3,20.64
  Top 0.61: X2.5 15.88,17.78
  Bottom 0.305: v16.83,20.64 16.83,31.43 21.91,36.51 26.04,36.51
  Bottom 0.406: 26.04,36.51 v26.99,35.56 | v7.3,20.64 v16.83,20.64
VCC_3V3  (via drill 0.3)
  Top 0.305: R1.2 37.27,21.72 v37.47,21.91
  Top 0.33: R3.2 R2.2
  Top 0.406: C16.1 C17.1 54.93,30.04 C15.1 C14.1 | IC2.1 54.92,27.3 | R4.2 v18.41,23.18 | R5.2 26.86,21.72 v26.99,21.59 | R3.2 v31.11,22.86 | LED1.A v5.71,18.1 | LED2.A v13.02,18.1 | 51.88,30.04 50.99,30.04 50.8,29.84 R11.1
  Top 0.5: 54.92,27.3 54.93,28.57 54.93,30.04 | IC1.1 54.92,44.64 | X1.5 38.73,16.83
  Top 0.6: 41.53,44.64 C7.1 | C14.1 51.88,30.04 v51.75,30.16
  Top 0.61: C10.1 C13.1 54.93,44.64 | 54.93,44.64 C12.1 C11.1 51.88,44.64 v51.75,44.77 | 54.92,44.64 54.93,44.64 | 41.09,50.67 40.96,50.8 41.27,50.8 41.59,51.12 41.59,52.59 C6.+ | L1.2 v45.4,19.37
  Top 0.813: L2.1 41.08,43.22 C7.1 C9.+ 41.09,50.67
  other vias: 39.37,54.05 39.37,55.33 40.96,55.33 37.78,55.33
  pour Top: 36.83,50.88 36.83,57.07 42.86,57.07 42.86,50.88
  pour layer3: 0.32,65.09 64.77,65.09 64.77,0.32 0.32,0.32

### Text on the board
tNames: Vin | 5V DC | GND | 3V3 | TRANSMIT | SFP experimenter | GND | (C) 2018 sysmocom GmbH / License: CC-BY-SA | RECEIVE | TX_FAULT | GND | TX_DISABLE | RATE_SEL | LOS | GND | MOD_DEF0/GND | MOD_DEF1/SCL | MOD_DEF2/SDA | VCC_3V3 | TX_FAULT | LOS